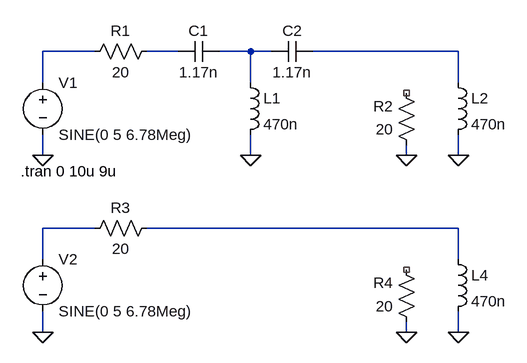
[diagram p0: schematic immittance_converter_test.asc]
immittance_converter_test.asc, the LTspice schematic file:
Version 4
SHEET 1 880 680
WIRE 16 32 -64 32
WIRE 144 32 96 32
WIRE 256 32 208 32
WIRE 288 32 256 32
WIRE 576 32 352 32
WIRE -64 80 -64 32
WIRE 256 80 256 32
WIRE 576 80 576 32
WIRE -64 192 -64 160
WIRE 256 192 256 160
WIRE 496 192 496 176
WIRE 576 192 576 160
WIRE 16 304 -64 304
WIRE 576 304 96 304
WIRE -64 352 -64 304
WIRE 576 352 576 304
WIRE -64 464 -64 432
WIRE 496 464 496 448
WIRE 576 464 576 432
FLAG -64 192 0
FLAG 256 192 0
FLAG 496 192 0
FLAG 576 192 0
FLAG -64 464 0
FLAG 496 464 0
FLAG 576 464 0
SYMBOL voltage -64 64 R0
WINDOW 123 0 0 Left 2
WINDOW 39 0 0 Left 2
SYMATTR InstName V1
SYMATTR Value SINE(0 5 6.78Meg)
SYMBOL res 112 16 R90
WINDOW 0 0 56 VBottom 2
WINDOW 3 32 56 VTop 2
SYMATTR InstName R1
SYMATTR Value 20
SYMBOL res 512 192 R180
WINDOW 0 36 76 Left 2
WINDOW 3 36 40 Left 2
SYMATTR InstName R2
SYMATTR Value 20
SYMBOL cap 144 48 R270
WINDOW 0 32 32 VTop 2
WINDOW 3 0 32 VBottom 2
SYMATTR InstName C1
SYMATTR Value 1.17n
SYMBOL cap 352 16 R90
WINDOW 0 0 32 VBottom 2
WINDOW 3 32 32 VTop 2
SYMATTR InstName C2
SYMATTR Value 1.17n
SYMBOL ind 240 64 R0
SYMATTR InstName L1
SYMATTR Value 470n
SYMBOL ind 560 64 R0
SYMATTR InstName L2
SYMATTR Value 470n
SYMBOL voltage -64 336 R0
WINDOW 123 0 0 Left 2
WINDOW 39 0 0 Left 2
SYMATTR InstName V2
SYMATTR Value SINE(0 5 6.78Meg)
SYMBOL res 112 288 R90
WINDOW 0 0 56 VBottom 2
WINDOW 3 32 56 VTop 2
SYMATTR InstName R3
SYMATTR Value 20
SYMBOL res 512 464 R180
WINDOW 0 36 76 Left 2
WINDOW 3 36 40 Left 2
SYMATTR InstName R4
SYMATTR Value 20
SYMBOL ind 560 336 R0
SYMATTR InstName L4
SYMATTR Value 470n
TEXT -98 216 Left 2 !.tran 0 10u 9u

The netlist it stands for:
* immittance_converter_test.asc
V1 N001 0 SINE(0 5 6.78Meg)
R1 N002 N001 20
R2 0 NC_01 20
C1 N002 N003 1.17n
C2 N004 N003 1.17n
L1 N003 0 470n
L2 N004 0 470n
V2 N005 0 SINE(0 5 6.78Meg)
R3 N006 N005 20
R4 0 NC_02 20
L4 N006 0 470n
.tran 0 10u 9u
.backanno
.end